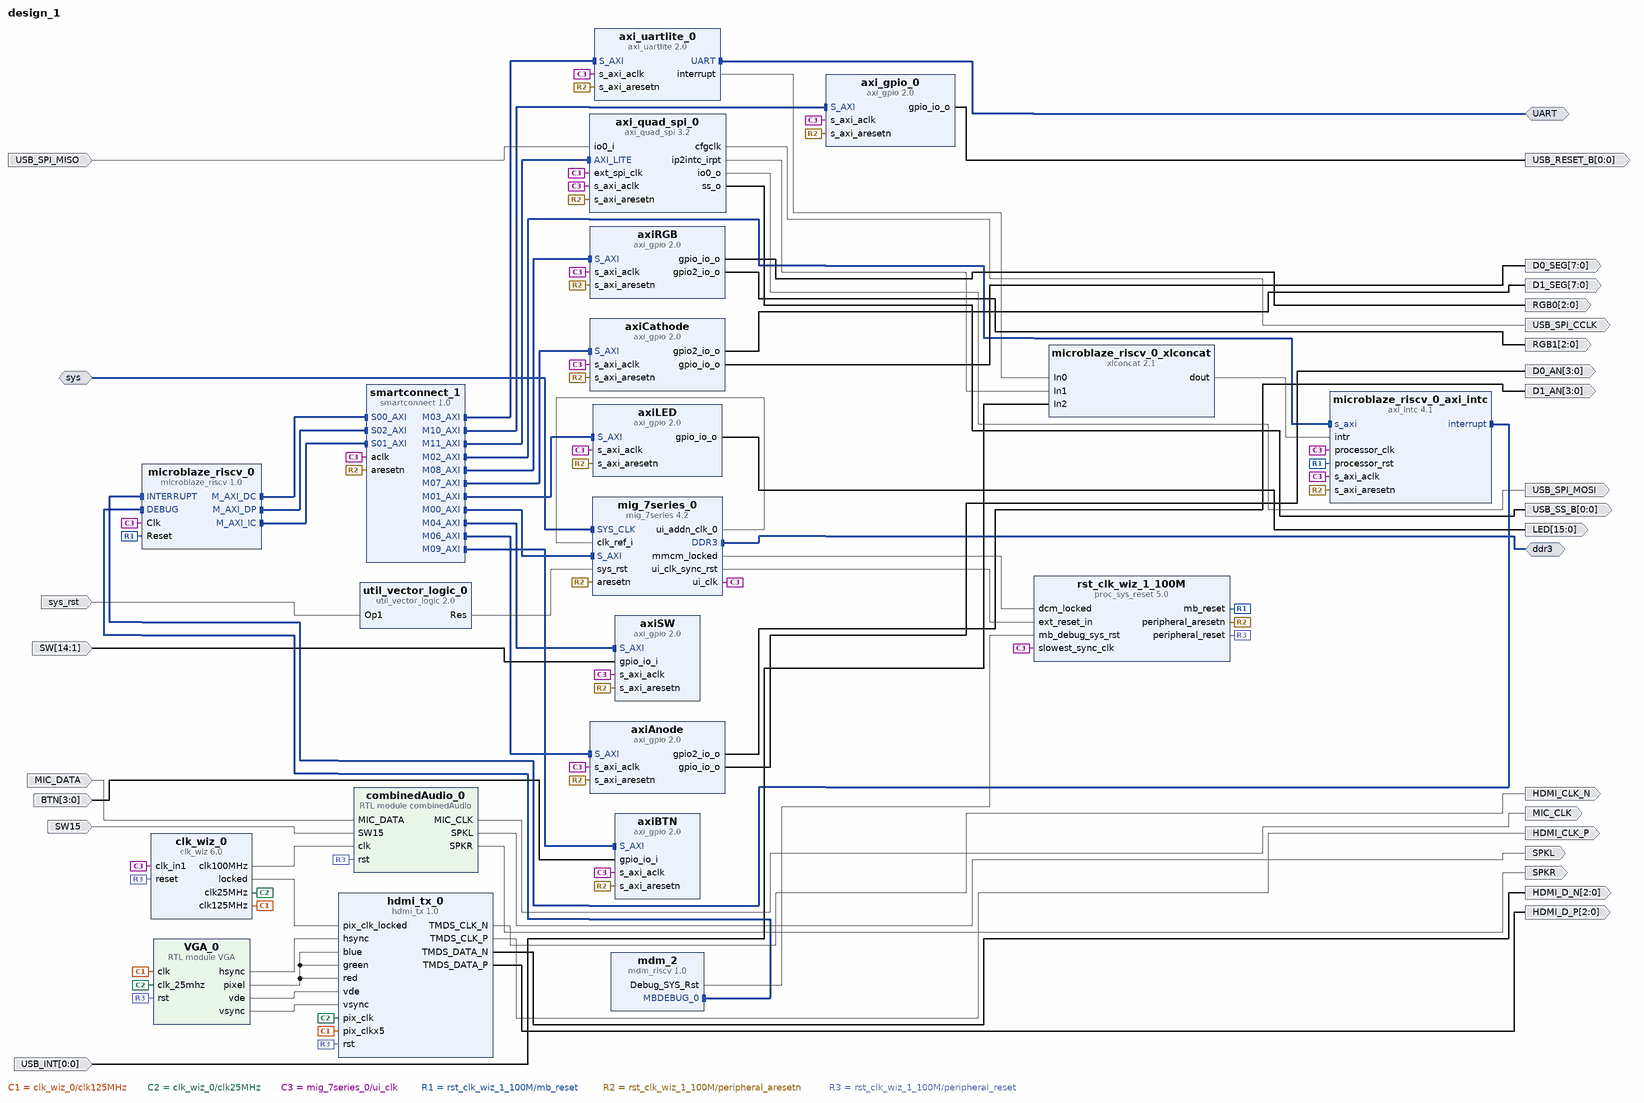
[diagram p0: block diagram of the top level]
# Vivado block design design_1, xc7s50csga324-1, Vivado 2024.1
create_bd_design design_1

create_bd_intf_port -mode Slave -vlnv xilinx.com:interface:diff_clock_rtl:1.0 sys
create_bd_intf_port -mode Master -vlnv xilinx.com:interface:ddrx_rtl:1.0 ddr3
create_bd_intf_port -mode Master -vlnv xilinx.com:interface:uart_rtl:1.0 UART
create_bd_port -dir I sys_rst
create_bd_port -dir O -from 15 -to 0 LED
create_bd_port -dir I -from 14 -to 1 SW
create_bd_port -dir O -type clk HDMI_CLK_N
create_bd_port -dir O -type clk HDMI_CLK_P
create_bd_port -dir O -from 2 -to 0 HDMI_D_P
create_bd_port -dir O -from 2 -to 0 HDMI_D_N
create_bd_port -dir O -type clk MIC_CLK
create_bd_port -dir O SPKL
create_bd_port -dir O SPKR
create_bd_port -dir I MIC_DATA
create_bd_port -dir I SW15
create_bd_port -dir O -from 2 -to 0 RGB0
create_bd_port -dir O -from 2 -to 0 RGB1
create_bd_port -dir O -from 3 -to 0 D0_AN
create_bd_port -dir O -from 3 -to 0 D1_AN
create_bd_port -dir O -from 7 -to 0 D0_SEG
create_bd_port -dir O -from 7 -to 0 D1_SEG
create_bd_port -dir I -from 3 -to 0 BTN
create_bd_port -dir I USB_SPI_MISO
create_bd_port -dir O USB_SPI_MOSI
create_bd_port -dir O USB_SPI_CCLK
create_bd_port -dir O -from 0 -to 0 USB_SS_B
create_bd_port -dir I -from 0 -to 0 USB_INT
create_bd_port -dir O -from 0 -to 0 USB_RESET_B

create_bd_cell -type ip -vlnv xilinx.com:ip:proc_sys_reset:5.0 rst_clk_wiz_1_100M
create_bd_cell -type ip -vlnv xilinx.com:ip:util_vector_logic:2.0 util_vector_logic_0
set_property -dict {CONFIG.C_OPERATION not CONFIG.C_SIZE 1} [get_bd_cells util_vector_logic_0]
create_bd_cell -type ip -vlnv xilinx.com:ip:microblaze_riscv:1.0 microblaze_riscv_0
set_property -dict [list \
  CONFIG.C_DEBUG_ENABLED 1 \
  CONFIG.C_D_AXI 1 \
  CONFIG.C_D_LMB 0 \
  CONFIG.C_I_LMB 0 \
  CONFIG.C_USE_DCACHE 1 \
  CONFIG.C_USE_ICACHE 1 \
  CONFIG.G_TEMPLATE_LIST 1 \
] [get_bd_cells microblaze_riscv_0]
create_bd_cell -type ip -vlnv xilinx.com:ip:axi_intc:4.1 microblaze_riscv_0_axi_intc
set_property -dict {CONFIG.C_HAS_FAST 1} [get_bd_cells microblaze_riscv_0_axi_intc]
create_bd_cell -type ip -vlnv xilinx.com:ip:mdm_riscv:1.0 mdm_2
create_bd_cell -type ip -vlnv xilinx.com:ip:xlconcat:2.1 microblaze_riscv_0_xlconcat
set_property -dict {CONFIG.NUM_PORTS 3} [get_bd_cells microblaze_riscv_0_xlconcat]
create_bd_cell -type ip -vlnv xilinx.com:ip:axi_gpio:2.0 axiLED
set_property -dict {CONFIG.C_ALL_OUTPUTS 1 CONFIG.C_GPIO_WIDTH 16} [get_bd_cells axiLED]
create_bd_cell -type ip -vlnv xilinx.com:ip:mig_7series:4.2 mig_7series_0
set_property -dict [list \
  CONFIG.BOARD_MIG_PARAM Custom \
  CONFIG.MIG_DONT_TOUCH_PARAM Custom \
  CONFIG.RESET_BOARD_INTERFACE Custom \
  CONFIG.XML_INPUT_FILE mig_a.prj \
] [get_bd_cells mig_7series_0]
create_bd_cell -type ip -vlnv xilinx.com:ip:smartconnect:1.0 smartconnect_1
set_property -dict {CONFIG.NUM_MI 12 CONFIG.NUM_SI 3} [get_bd_cells smartconnect_1]
create_bd_cell -type ip -vlnv xilinx.com:ip:axi_uartlite:2.0 axi_uartlite_0
set_property -dict {CONFIG.C_BAUDRATE 115200 CONFIG.C_S_AXI_ACLK_FREQ_HZ 83333333} [get_bd_cells axi_uartlite_0]
create_bd_cell -type ip -vlnv xilinx.com:ip:axi_gpio:2.0 axiSW
set_property -dict {CONFIG.C_ALL_INPUTS 1 CONFIG.C_GPIO_WIDTH 14} [get_bd_cells axiSW]
create_bd_cell -type ip -vlnv xilinx.com:ip:clk_wiz:6.0 clk_wiz_0
set_property -dict [list \
  CONFIG.CLKOUT1_JITTER 185.047 \
  CONFIG.CLKOUT1_PHASE_ERROR 100.585 \
  CONFIG.CLKOUT1_REQUESTED_OUT_FREQ 25.000 \
  CONFIG.CLKOUT2_JITTER 130.073 \
  CONFIG.CLKOUT2_PHASE_ERROR 100.585 \
  CONFIG.CLKOUT2_REQUESTED_OUT_FREQ 125.000 \
  CONFIG.CLKOUT2_USED true \
  CONFIG.CLKOUT3_JITTER 135.991 \
  CONFIG.CLKOUT3_PHASE_ERROR 100.585 \
  CONFIG.CLKOUT3_REQUESTED_OUT_FREQ 100.000 \
  CONFIG.CLKOUT3_USED true \
  CONFIG.CLK_OUT1_PORT clk25MHz \
  CONFIG.CLK_OUT2_PORT clk125MHz \
  CONFIG.CLK_OUT3_PORT clk100MHz \
  CONFIG.MMCM_CLKFBOUT_MULT_F 12.000 \
  CONFIG.MMCM_CLKOUT0_DIVIDE_F 40.000 \
  CONFIG.MMCM_CLKOUT1_DIVIDE 8 \
  CONFIG.MMCM_CLKOUT2_DIVIDE 10 \
  CONFIG.MMCM_DIVCLK_DIVIDE 1 \
  CONFIG.NUM_OUT_CLKS 3 \
] [get_bd_cells clk_wiz_0]
create_bd_cell -type ip -vlnv realdigital.org:realdigital:hdmi_tx:1.0 hdmi_tx_0
set_property -dict {CONFIG.C_BLUE_WIDTH 3 CONFIG.C_GREEN_WIDTH 3 CONFIG.C_RED_WIDTH 3 CONFIG.MODE HDMI} [get_bd_cells hdmi_tx_0]
create_bd_cell -type module -reference VGA VGA_0
create_bd_cell -type module -reference combinedAudio combinedAudio_0
create_bd_cell -type ip -vlnv xilinx.com:ip:axi_gpio:2.0 axiRGB
set_property -dict [list \
  CONFIG.C_ALL_INPUTS 0 \
  CONFIG.C_ALL_OUTPUTS 1 \
  CONFIG.C_ALL_OUTPUTS_2 1 \
  CONFIG.C_GPIO2_WIDTH 3 \
  CONFIG.C_GPIO_WIDTH 3 \
  CONFIG.C_IS_DUAL 1 \
] [get_bd_cells axiRGB]
create_bd_cell -type ip -vlnv xilinx.com:ip:axi_gpio:2.0 axiAnode
set_property -dict [list \
  CONFIG.C_ALL_OUTPUTS 1 \
  CONFIG.C_ALL_OUTPUTS_2 1 \
  CONFIG.C_GPIO2_WIDTH 4 \
  CONFIG.C_GPIO_WIDTH 4 \
  CONFIG.C_IS_DUAL 1 \
] [get_bd_cells axiAnode]
create_bd_cell -type ip -vlnv xilinx.com:ip:axi_gpio:2.0 axiCathode
set_property -dict [list \
  CONFIG.C_ALL_OUTPUTS 1 \
  CONFIG.C_ALL_OUTPUTS_2 1 \
  CONFIG.C_GPIO2_WIDTH 8 \
  CONFIG.C_GPIO_WIDTH 8 \
  CONFIG.C_IS_DUAL 1 \
] [get_bd_cells axiCathode]
create_bd_cell -type ip -vlnv xilinx.com:ip:axi_gpio:2.0 axiBTN
set_property -dict {CONFIG.C_ALL_INPUTS 1 CONFIG.C_GPIO_WIDTH 4} [get_bd_cells axiBTN]
create_bd_cell -type ip -vlnv xilinx.com:ip:axi_quad_spi:3.2 axi_quad_spi_0
create_bd_cell -type ip -vlnv xilinx.com:ip:axi_gpio:2.0 axi_gpio_0
set_property -dict {CONFIG.C_ALL_OUTPUTS 1 CONFIG.C_GPIO_WIDTH 1 CONFIG.C_IS_DUAL 0} [get_bd_cells axi_gpio_0]

# ---- connections ----

connect_bd_intf_net -intf_net SYS_CLK_0_1 [get_bd_intf_ports sys] [get_bd_intf_pins mig_7series_0/SYS_CLK]
connect_bd_intf_net [get_bd_intf_ports UART] [get_bd_intf_pins axi_uartlite_0/UART]
connect_bd_intf_net [get_bd_intf_pins smartconnect_1/S00_AXI] [get_bd_intf_pins microblaze_riscv_0/M_AXI_DC]
connect_bd_intf_net [get_bd_intf_pins microblaze_riscv_0/M_AXI_DP] [get_bd_intf_pins smartconnect_1/S02_AXI]
connect_bd_intf_net [get_bd_intf_pins smartconnect_1/S01_AXI] [get_bd_intf_pins microblaze_riscv_0/M_AXI_IC]
connect_bd_intf_net [get_bd_intf_pins mdm_2/MBDEBUG_0] [get_bd_intf_pins microblaze_riscv_0/DEBUG]
connect_bd_intf_net [get_bd_intf_pins microblaze_riscv_0_axi_intc/interrupt] [get_bd_intf_pins microblaze_riscv_0/INTERRUPT]
connect_bd_intf_net [get_bd_intf_ports ddr3] [get_bd_intf_pins mig_7series_0/DDR3]
connect_bd_intf_net [get_bd_intf_pins smartconnect_1/M00_AXI] [get_bd_intf_pins mig_7series_0/S_AXI]
connect_bd_intf_net [get_bd_intf_pins axiLED/S_AXI] [get_bd_intf_pins smartconnect_1/M01_AXI]
connect_bd_intf_net [get_bd_intf_pins microblaze_riscv_0_axi_intc/s_axi] [get_bd_intf_pins smartconnect_1/M02_AXI]
connect_bd_intf_net [get_bd_intf_pins axi_uartlite_0/S_AXI] [get_bd_intf_pins smartconnect_1/M03_AXI]
connect_bd_intf_net [get_bd_intf_pins axiSW/S_AXI] [get_bd_intf_pins smartconnect_1/M04_AXI]
connect_bd_intf_net [get_bd_intf_pins smartconnect_1/M06_AXI] [get_bd_intf_pins axiAnode/S_AXI]
connect_bd_intf_net [get_bd_intf_pins smartconnect_1/M07_AXI] [get_bd_intf_pins axiCathode/S_AXI]
connect_bd_intf_net [get_bd_intf_pins smartconnect_1/M08_AXI] [get_bd_intf_pins axiRGB/S_AXI]
connect_bd_intf_net [get_bd_intf_pins smartconnect_1/M09_AXI] [get_bd_intf_pins axiBTN/S_AXI]
connect_bd_intf_net [get_bd_intf_pins smartconnect_1/M10_AXI] [get_bd_intf_pins axi_gpio_0/S_AXI]
connect_bd_intf_net [get_bd_intf_pins smartconnect_1/M11_AXI] [get_bd_intf_pins axi_quad_spi_0/AXI_LITE]
connect_bd_net -net In2_0_1 [get_bd_ports USB_INT] [get_bd_pins microblaze_riscv_0_xlconcat/In2]
connect_bd_net -net MIC_DATA_0_1 [get_bd_ports MIC_DATA] [get_bd_pins combinedAudio_0/MIC_DATA]
connect_bd_net -net SW15_0_1 [get_bd_ports SW15] [get_bd_pins combinedAudio_0/SW15]
connect_bd_net [get_bd_ports SW] [get_bd_pins axiSW/gpio_io_i]
connect_bd_net [get_bd_pins VGA_0/hsync] [get_bd_pins hdmi_tx_0/hsync]
connect_bd_net [get_bd_pins VGA_0/pixel] [get_bd_pins hdmi_tx_0/blue] [get_bd_pins hdmi_tx_0/green] [get_bd_pins hdmi_tx_0/red]
connect_bd_net [get_bd_pins VGA_0/vde] [get_bd_pins hdmi_tx_0/vde]
connect_bd_net [get_bd_pins VGA_0/vsync] [get_bd_pins hdmi_tx_0/vsync]
connect_bd_net [get_bd_pins axiAnode/gpio2_io_o] [get_bd_ports D1_AN]
connect_bd_net [get_bd_pins axiAnode/gpio_io_o] [get_bd_ports D0_AN]
connect_bd_net [get_bd_pins axiCathode/gpio2_io_o] [get_bd_ports D1_SEG]
connect_bd_net [get_bd_pins axiCathode/gpio_io_o] [get_bd_ports D0_SEG]
connect_bd_net [get_bd_pins axiRGB/gpio2_io_o] [get_bd_ports RGB1]
connect_bd_net [get_bd_pins axiRGB/gpio_io_o] [get_bd_ports RGB0]
connect_bd_net -net axi_gpio_0_gpio_io_o [get_bd_pins axiLED/gpio_io_o] [get_bd_ports LED]
connect_bd_net [get_bd_pins axi_gpio_0/gpio_io_o] [get_bd_ports USB_RESET_B]
connect_bd_net [get_bd_pins axi_quad_spi_0/cfgclk] [get_bd_ports USB_SPI_CCLK]
connect_bd_net [get_bd_pins axi_quad_spi_0/io0_o] [get_bd_ports USB_SPI_MOSI]
connect_bd_net [get_bd_pins axi_quad_spi_0/ip2intc_irpt] [get_bd_pins microblaze_riscv_0_xlconcat/In1]
connect_bd_net [get_bd_pins axi_quad_spi_0/ss_o] [get_bd_ports USB_SS_B]
connect_bd_net [get_bd_pins axi_uartlite_0/interrupt] [get_bd_pins microblaze_riscv_0_xlconcat/In0]
connect_bd_net [get_bd_pins clk_wiz_0/clk100MHz] [get_bd_pins combinedAudio_0/clk]
connect_bd_net [get_bd_pins clk_wiz_0/clk125MHz] [get_bd_pins hdmi_tx_0/pix_clkx5] [get_bd_pins VGA_0/clk]
connect_bd_net [get_bd_pins clk_wiz_0/clk25MHz] [get_bd_pins hdmi_tx_0/pix_clk] [get_bd_pins VGA_0/clk_25mhz]
connect_bd_net [get_bd_pins clk_wiz_0/locked] [get_bd_pins hdmi_tx_0/pix_clk_locked]
connect_bd_net [get_bd_pins combinedAudio_0/MIC_CLK] [get_bd_ports MIC_CLK]
connect_bd_net [get_bd_pins combinedAudio_0/SPKL] [get_bd_ports SPKL]
connect_bd_net [get_bd_pins combinedAudio_0/SPKR] [get_bd_ports SPKR]
connect_bd_net -net gpio_io_i_1_1 [get_bd_ports BTN] [get_bd_pins axiBTN/gpio_io_i]
connect_bd_net [get_bd_pins hdmi_tx_0/TMDS_CLK_N] [get_bd_ports HDMI_CLK_N]
connect_bd_net [get_bd_pins hdmi_tx_0/TMDS_CLK_P] [get_bd_ports HDMI_CLK_P]
connect_bd_net [get_bd_pins hdmi_tx_0/TMDS_DATA_N] [get_bd_ports HDMI_D_N]
connect_bd_net [get_bd_pins hdmi_tx_0/TMDS_DATA_P] [get_bd_ports HDMI_D_P]
connect_bd_net -net io0_i_0_1 [get_bd_ports USB_SPI_MISO] [get_bd_pins axi_quad_spi_0/io0_i]
connect_bd_net [get_bd_pins mdm_2/Debug_SYS_Rst] [get_bd_pins rst_clk_wiz_1_100M/mb_debug_sys_rst]
connect_bd_net -net microblaze_riscv_0_Clk [get_bd_pins mig_7series_0/ui_clk] \
  [get_bd_pins rst_clk_wiz_1_100M/slowest_sync_clk] [get_bd_pins microblaze_riscv_0/Clk] \
  [get_bd_pins microblaze_riscv_0_axi_intc/s_axi_aclk] [get_bd_pins microblaze_riscv_0_axi_intc/processor_clk] \
  [get_bd_pins clk_wiz_0/clk_in1] [get_bd_pins axiLED/s_axi_aclk] [get_bd_pins axiSW/s_axi_aclk] \
  [get_bd_pins axi_uartlite_0/s_axi_aclk] [get_bd_pins smartconnect_1/aclk] [get_bd_pins axiAnode/s_axi_aclk] \
  [get_bd_pins axiCathode/s_axi_aclk] [get_bd_pins axiRGB/s_axi_aclk] [get_bd_pins axiBTN/s_axi_aclk] \
  [get_bd_pins axi_gpio_0/s_axi_aclk] [get_bd_pins axi_quad_spi_0/s_axi_aclk] [get_bd_pins axi_quad_spi_0/ext_spi_clk]
connect_bd_net -net microblaze_riscv_0_intr [get_bd_pins microblaze_riscv_0_xlconcat/dout] [get_bd_pins microblaze_riscv_0_axi_intc/intr]
connect_bd_net [get_bd_pins mig_7series_0/mmcm_locked] [get_bd_pins rst_clk_wiz_1_100M/dcm_locked]
connect_bd_net [get_bd_pins mig_7series_0/ui_addn_clk_0] [get_bd_pins mig_7series_0/clk_ref_i]
connect_bd_net [get_bd_pins mig_7series_0/ui_clk_sync_rst] [get_bd_pins rst_clk_wiz_1_100M/ext_reset_in]
connect_bd_net [get_bd_pins rst_clk_wiz_1_100M/mb_reset] \
  [get_bd_pins microblaze_riscv_0/Reset] [get_bd_pins microblaze_riscv_0_axi_intc/processor_rst]
connect_bd_net [get_bd_pins rst_clk_wiz_1_100M/peripheral_aresetn] \
  [get_bd_pins microblaze_riscv_0_axi_intc/s_axi_aresetn] [get_bd_pins mig_7series_0/aresetn] \
  [get_bd_pins axiLED/s_axi_aresetn] [get_bd_pins axiSW/s_axi_aresetn] [get_bd_pins axi_uartlite_0/s_axi_aresetn] \
  [get_bd_pins smartconnect_1/aresetn] [get_bd_pins axiAnode/s_axi_aresetn] [get_bd_pins axiCathode/s_axi_aresetn] \
  [get_bd_pins axiRGB/s_axi_aresetn] [get_bd_pins axiBTN/s_axi_aresetn] [get_bd_pins axi_gpio_0/s_axi_aresetn] \
  [get_bd_pins axi_quad_spi_0/s_axi_aresetn]
connect_bd_net [get_bd_pins rst_clk_wiz_1_100M/peripheral_reset] \
  [get_bd_pins clk_wiz_0/reset] [get_bd_pins hdmi_tx_0/rst] [get_bd_pins VGA_0/rst] [get_bd_pins combinedAudio_0/rst]
connect_bd_net [get_bd_ports sys_rst] [get_bd_pins util_vector_logic_0/Op1]
connect_bd_net [get_bd_pins util_vector_logic_0/Res] [get_bd_pins mig_7series_0/sys_rst]
set_property HDL_ATTRIBUTE.BMM_INFO_PROCESSOR {riscv > design_1 microblaze_riscv_0_local_memory/dlmb_bram_if_cntlr} [get_bd_cells microblaze_riscv_0]
set_property HDL_ATTRIBUTE.KEEP_HIERARCHY yes [get_bd_cells microblaze_riscv_0]

# ---- address map ----
assign_bd_address -offset 0x00000000 -range 128M -target_address_space [get_bd_addr_spaces microblaze_riscv_0/Data] [get_bd_addr_segs mig_7series_0/memmap/memaddr]
assign_bd_address -offset 0x40000000 -range 64K -target_address_space [get_bd_addr_spaces microblaze_riscv_0/Data] [get_bd_addr_segs axiLED/S_AXI/Reg]
assign_bd_address -offset 0x40010000 -range 64K -target_address_space [get_bd_addr_spaces microblaze_riscv_0/Data] [get_bd_addr_segs axiSW/S_AXI/Reg]
assign_bd_address -offset 0x40020000 -range 64K -target_address_space [get_bd_addr_spaces microblaze_riscv_0/Data] [get_bd_addr_segs axiAnode/S_AXI/Reg]
assign_bd_address -offset 0x40030000 -range 64K -target_address_space [get_bd_addr_spaces microblaze_riscv_0/Data] [get_bd_addr_segs axiCathode/S_AXI/Reg]
assign_bd_address -offset 0x40040000 -range 64K -target_address_space [get_bd_addr_spaces microblaze_riscv_0/Data] [get_bd_addr_segs axiRGB/S_AXI/Reg]
assign_bd_address -offset 0x40050000 -range 64K -target_address_space [get_bd_addr_spaces microblaze_riscv_0/Data] [get_bd_addr_segs axiBTN/S_AXI/Reg]
assign_bd_address -offset 0x40060000 -range 64K -target_address_space [get_bd_addr_spaces microblaze_riscv_0/Data] [get_bd_addr_segs axi_gpio_0/S_AXI/Reg]
assign_bd_address -offset 0x40600000 -range 64K -target_address_space [get_bd_addr_spaces microblaze_riscv_0/Data] [get_bd_addr_segs axi_uartlite_0/S_AXI/Reg]
assign_bd_address -offset 0x41200000 -range 64K -target_address_space [get_bd_addr_spaces microblaze_riscv_0/Data] [get_bd_addr_segs microblaze_riscv_0_axi_intc/S_AXI/Reg]
assign_bd_address -offset 0x44A10000 -range 64K -target_address_space [get_bd_addr_spaces microblaze_riscv_0/Data] [get_bd_addr_segs axi_quad_spi_0/AXI_LITE/Reg]
assign_bd_address -offset 0x00000000 -range 128M -target_address_space [get_bd_addr_spaces microblaze_riscv_0/Instruction] [get_bd_addr_segs mig_7series_0/memmap/memaddr]
assign_bd_address -offset 0x40000000 -range 64K -target_address_space [get_bd_addr_spaces microblaze_riscv_0/Instruction] [get_bd_addr_segs axiLED/S_AXI/Reg]
assign_bd_address -offset 0x40010000 -range 64K -target_address_space [get_bd_addr_spaces microblaze_riscv_0/Instruction] [get_bd_addr_segs axiSW/S_AXI/Reg]
assign_bd_address -offset 0x40020000 -range 64K -target_address_space [get_bd_addr_spaces microblaze_riscv_0/Instruction] [get_bd_addr_segs axiAnode/S_AXI/Reg]
assign_bd_address -offset 0x40030000 -range 64K -target_address_space [get_bd_addr_spaces microblaze_riscv_0/Instruction] [get_bd_addr_segs axiCathode/S_AXI/Reg]
assign_bd_address -offset 0x40040000 -range 64K -target_address_space [get_bd_addr_spaces microblaze_riscv_0/Instruction] [get_bd_addr_segs axiRGB/S_AXI/Reg]
assign_bd_address -offset 0x40050000 -range 64K -target_address_space [get_bd_addr_spaces microblaze_riscv_0/Instruction] [get_bd_addr_segs axiBTN/S_AXI/Reg]
assign_bd_address -offset 0x40060000 -range 64K -target_address_space [get_bd_addr_spaces microblaze_riscv_0/Instruction] [get_bd_addr_segs axi_gpio_0/S_AXI/Reg]
assign_bd_address -offset 0x40600000 -range 64K -target_address_space [get_bd_addr_spaces microblaze_riscv_0/Instruction] [get_bd_addr_segs axi_uartlite_0/S_AXI/Reg]
assign_bd_address -offset 0x41200000 -range 64K -target_address_space [get_bd_addr_spaces microblaze_riscv_0/Instruction] [get_bd_addr_segs microblaze_riscv_0_axi_intc/S_AXI/Reg]
assign_bd_address -offset 0x44A10000 -range 64K -target_address_space [get_bd_addr_spaces microblaze_riscv_0/Instruction] [get_bd_addr_segs axi_quad_spi_0/AXI_LITE/Reg]

validate_bd_design
save_bd_design
